# EAGLE design MMaster (EAGLE 6.5.0)
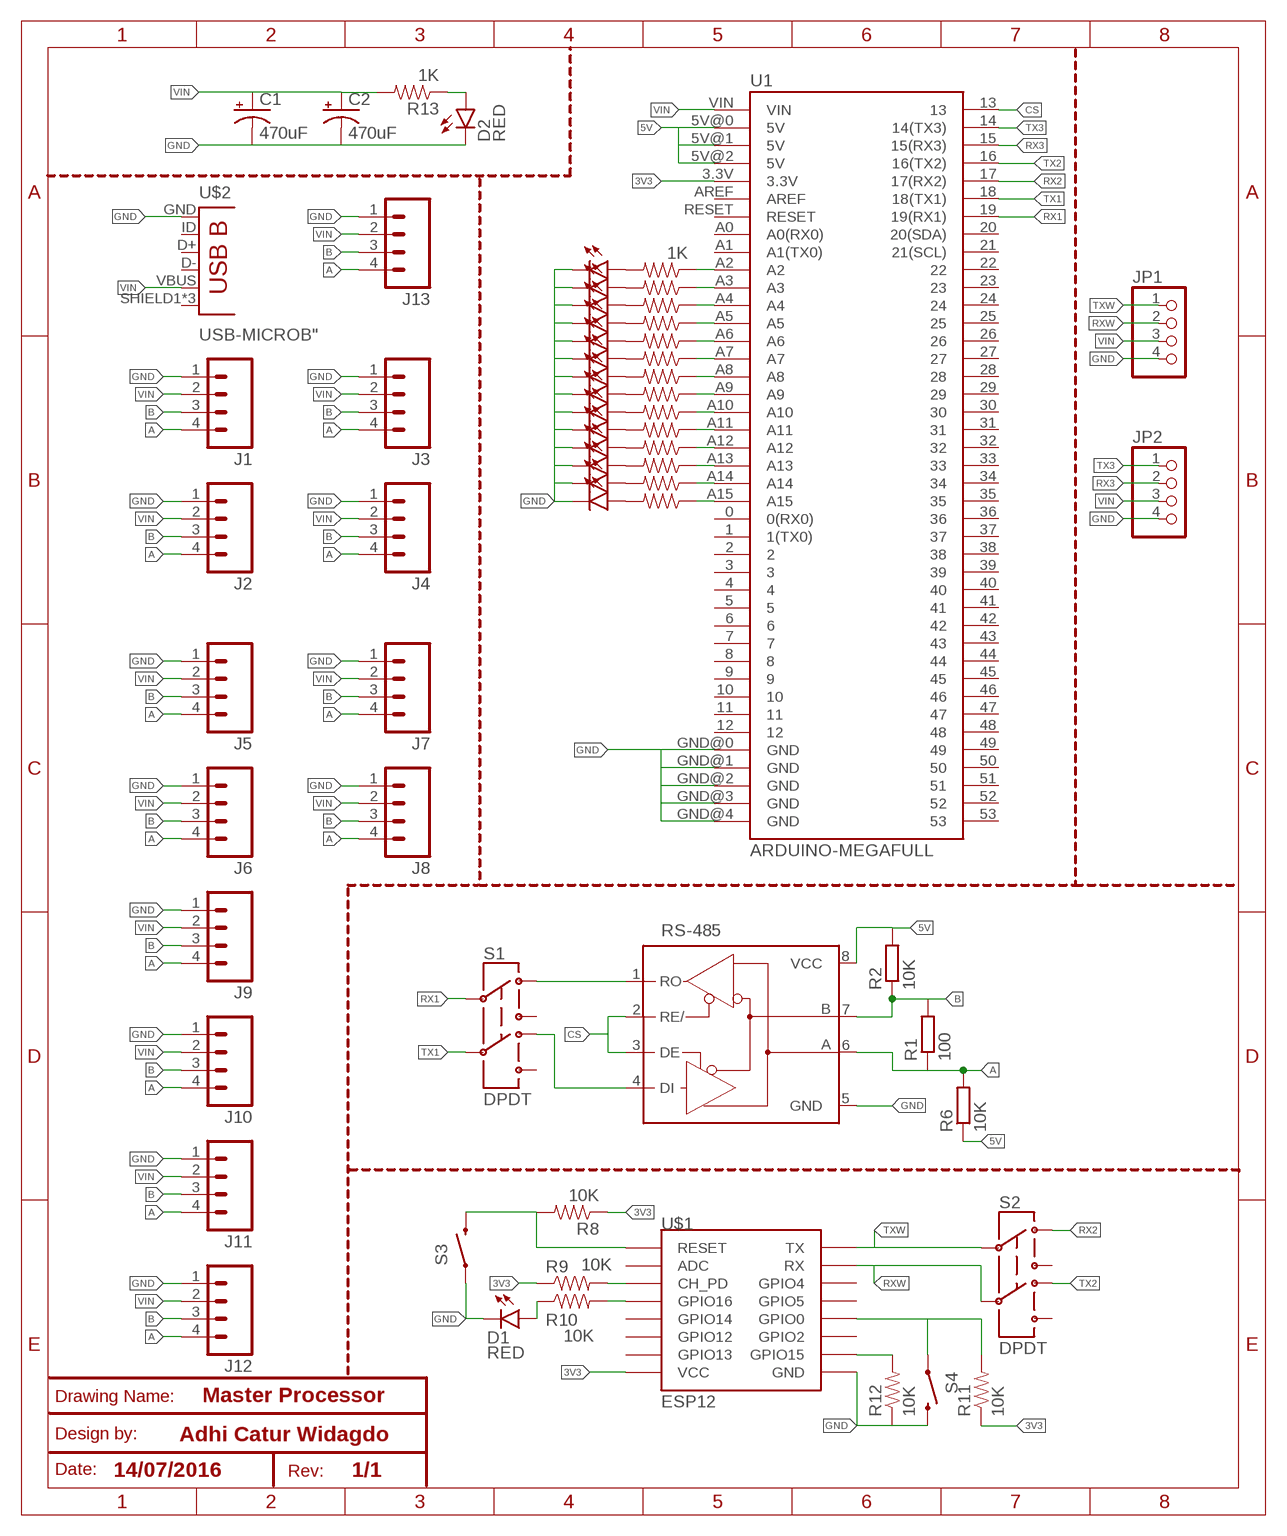
[diagram p0: schematic, sheet 1]

## Parts
C1  470uF  CPOL-USE3.5-8  [E3,5-8]
C2  470uF  CPOL-USE3.5-8  [E3,5-8]
D1  RED  LED-RED0603  [LED-0603]
D2  RED  LED-RED0603  [LED-0603]
D3  RED  LED-RED0603  [LED-0603]
D4  RED  LED-RED0603  [LED-0603]
D5  RED  LED-RED0603  [LED-0603]
D6  RED  LED-RED0603  [LED-0603]
D7  RED  LED-RED0603  [LED-0603]
D8  RED  LED-RED0603  [LED-0603]
D9  RED  LED-RED0603  [LED-0603]
D10  RED  LED-RED0603  [LED-0603]
D11  RED  LED-RED0603  [LED-0603]
D12  RED  LED-RED0603  [LED-0603]
D13  RED  LED-RED0603  [LED-0603]
D14  RED  LED-RED0603  [LED-0603]
D15  RED  LED-RED0603  [LED-0603]
D16  RED  LED-RED0603  [LED-0603]
J1  M04POLAR  [MOLEX-1X4]
J2  M04POLAR  [MOLEX-1X4]
J3  M04POLAR  [MOLEX-1X4]
J4  M04POLAR  [MOLEX-1X4]
J5  M04POLAR  [MOLEX-1X4]
J6  M04POLAR  [MOLEX-1X4]
J7  M04POLAR  [MOLEX-1X4]
J8  M04POLAR  [MOLEX-1X4]
J9  M04POLAR  [MOLEX-1X4]
J10  M04POLAR  [MOLEX-1X4]
J11  M04POLAR  [MOLEX-1X4]
J12  M04POLAR  [MOLEX-1X4]
J13  M04POLAR  [MOLEX-1X4]
JP1  PINHD-1X4  [1X04]
JP2  PINHD-1X4  [1X04]
R1  100  R-EU_0204/7  [0204/7]
R2  10K  R-EU_0204/7  [0204/7]
R6  10K  R-EU_0204/7  [0204/7]
R8  10K  10KOHM-1/10W-1%(0603)0603  [0603-RES]
R9  10K  10KOHM-1/10W-1%(0603)0603  [0603-RES]
R10  10K  10KOHM-1/10W-1%(0603)0603  [0603-RES]
R11  10K  10KOHM-1/10W-1%(0603)0603  [0603-RES]
R12  10K  10KOHM-1/10W-1%(0603)0603  [0603-RES]
R13  1K  10KOHM-1/10W-1%(0603)0603  [0603-RES]
R14  1K  10KOHM-1/10W-1%(0603)0603  [0603-RES]
R15  1K  10KOHM-1/10W-1%(0603)0603  [0603-RES]
R16  1K  10KOHM-1/10W-1%(0603)0603  [0603-RES]
R17  1K  10KOHM-1/10W-1%(0603)0603  [0603-RES]
R18  1K  10KOHM-1/10W-1%(0603)0603  [0603-RES]
R19  1K  10KOHM-1/10W-1%(0603)0603  [0603-RES]
R20  1K  10KOHM-1/10W-1%(0603)0603  [0603-RES]
R21  1K  10KOHM-1/10W-1%(0603)0603  [0603-RES]
R22  1K  10KOHM-1/10W-1%(0603)0603  [0603-RES]
R23  1K  10KOHM-1/10W-1%(0603)0603  [0603-RES]
R24  1K  10KOHM-1/10W-1%(0603)0603  [0603-RES]
R25  1K  10KOHM-1/10W-1%(0603)0603  [0603-RES]
R26  1K  10KOHM-1/10W-1%(0603)0603  [0603-RES]
R27  1K  10KOHM-1/10W-1%(0603)0603  [0603-RES]
RS-485  MAX3468CPA  [DIL08]
S1  DPDT  SWITCH-DPDTAYZ0202  [AYZ0202]
S2  DPDT  SWITCH-DPDTAYZ0202  [AYZ0202]
S3  SWITCH-MOMENTARY-2SMD-1101NE  [TACTILE-SWITCH-1101NE]
S4  SWITCH-MOMENTARY-2SMD-1101NE  [TACTILE-SWITCH-1101NE]
U1  ARDUINO-MEGAFULL  [ARDUINO_MEGA]
U$1  ESP12  [ESP12]
U$2  USB-MICROB"  [USB-B-MICRO-SMD_V03]

## Nets
3V3: R8.1 R9.1 R11.1 U1.3.3V U$1.VCC
5V: R2.2 R6.1 RS-485.8(VCC) U1.5V@0(5V) U1.5V@1(5V) U1.5V@2(5V)
A: J1.4 J2.4 J3.4 J4.4 J5.4 J6.4 J7.4 J8.4 J9.4 J10.4 J11.4 J12.4 J13.4 R1.1 R6.2 RS-485.6(A)
B: J1.3 J2.3 J3.3 J4.3 J5.3 J6.3 J7.3 J8.3 J9.3 J10.3 J11.3 J12.3 J13.3 R1.2 R2.1 RS-485.7(B)
CS: RS-485.2(RE/) RS-485.3(DE) U1.13
GND: C1.- C2.- D1.C D2.C D3.C D4.C D5.C D6.C D7.C D8.C D9.C D10.C D11.C D12.C D13.C D14.C D15.C D16.C J1.1 J2.1 J3.1 J4.1 J5.1 J6.1 J7.1 J8.1 J9.1 J10.1 J11.1 J12.1 J13.1 JP1.4 JP2.4 R12.1 RS-485.5(GND) S3.1 S4.2 U1.GND@0(GND) U1.GND@1(GND) U1.GND@2(GND) U1.GND@3(GND) U1.GND@4(GND) U$1.GND U$2.GND
N$1: RS-485.1(RO) S1.1
N$2: RS-485.4(DI) S1.4
N$3: R12.2 U$1.GPIO15
N$4: R10.2 U$1.GPIO16
N$5: R11.2 S4.1 U$1.GPIO0
N$6: D1.A R10.1
N$7: R8.2 S3.2 U$1.RESET
N$8: R9.2 U$1.CH_PD
N$9: D2.A R13.1
N$10: R27.1 U1.A15
N$11: R26.1 U1.A14
N$12: R25.1 U1.A13
N$13: R24.1 U1.A12
N$14: R23.1 U1.A11
N$15: R22.1 U1.A10
N$16: R21.1 U1.A9
N$17: R20.1 U1.A8
N$18: R19.1 U1.A7
N$19: R18.1 U1.A6
N$20: R17.1 U1.A5
N$21: R16.1 U1.A4
N$22: R15.1 U1.A3
N$23: R14.1 U1.A2
N$24: D3.A R14.2
N$25: D4.A R15.2
N$26: D5.A R16.2
N$27: D6.A R17.2
N$28: D7.A R18.2
N$29: D8.A R19.2
N$30: D9.A R20.2
N$31: D10.A R21.2
N$32: D11.A R22.2
N$33: D12.A R23.2
N$34: D13.A R24.2
N$35: D14.A R25.2
N$36: D15.A R26.2
N$37: D16.A R27.2
RX1: S1.2 U1.19(19(RX1))
RX2: S2.1 U1.17(17(RX2))
RX3: JP2.2 U1.15(15(RX3))
RXW: JP1.2 S2.5 U$1.RX
TX1: S1.5 U1.18(18(TX1))
TX2: S2.4 U1.16(16(TX2))
TX3: JP2.1 U1.14(14(TX3))
TXW: JP1.1 S2.2 U$1.TX
VIN: C1.+ C2.+ J1.2 J2.2 J3.2 J4.2 J5.2 J6.2 J7.2 J8.2 J9.2 J10.2 J11.2 J12.2 J13.2 JP1.3 JP2.3 R13.2 U1.VIN U$2.VBUS
Unconnected: S1.3 S1.6 S2.3 S2.6 U1.0(0(RX0)) U1.1(1(TX0)) U1.2 U1.3 U1.4 U1.5 U1.6 U1.7 U1.8 U1.9 U1.10 U1.11 U1.12 U1.20(20(SDA)) U1.21(21(SCL)) U1.22 U1.23 U1.24 U1.25 U1.26 U1.27 U1.28 U1.29 U1.30 U1.31 U1.32 U1.33 U1.34 U1.35 U1.36 U1.37 U1.38 U1.39 U1.40 U1.41 U1.42 U1.43 U1.44 U1.45 U1.46 U1.47 U1.48 U1.49 U1.50 U1.51 U1.52 U1.53 U1.A0(A0(RX0)) U1.A1(A1(TX0)) U1.AREF U1.RESET U$1.ADC U$1.GPIO2 U$1.GPIO4 U$1.GPIO5 U$1.GPIO12 U$1.GPIO13 U$1.GPIO14 U$2.D+ U$2.D- U$2.ID(USBID) U$2.SHIELD1(SHIELD) U$2.SHIELD2(SHIELD) U$2.SHIELD3(SHIELD)

## Notes on the sheet
- Drawing Name: | Master Processor
- Design by: | Adhi Catur Widagdo
- Date: | 14/07/2016 | Rev: | 1/1

## Library data of the parts
C1 C2 = rcl:CPOL-US: POLARIZED CAPACITOR, American symbol
D1-D16 = SparkFun-LED:LED-RED: Assorted Red LEDs LilyPad 1206- DIO-09912 1206- DIO-00809 0603- DIO-00819 "SMART" means more efficient and expensive; PROD_ID: DIO-00819
J1-J13 = SparkFun-Connectors:M04: Header 4 Standard 4-pin 0.1" header. Use with straight break away headers (SKU : PRT-00116), right angle break away headers (PRT-00553), swiss pins (PRT-00743), machine pins (PRT-00117), and female headers (PRT-00115). Molex polarized connector foot print use with SKU : PRT-08231 with associated crimp pins and housings. 1MM SMD Version SKU: PRT-10208
JP1 JP2 = pinhead:PINHD-1X4: PIN HEADER
R1 R2 R6 = rcl:R-EU_: RESISTOR, European symbol
R8-R12 = SparkFun-Resistors:10KOHM-1/10W-1%(0603): RES-00824; PROD_ID: RES-00824
R13-R27 = SparkFun-Resistors:10KOHM-1/10W-1%(0603): RES-00824; PROD_ID: RES-00824; VALUE: 10K
RS-485 = maxim:MAX34*: +5V, Fail-Safe, 40Mbps, Profibus RS-485/RS-422 Transceivers Source: MAX3465-MAX3469.pdf; OC_FARNELL: unknown; OC_NEWARK: unknown
S1 S2 = SparkFun-Electromechanical:SWITCH-DPDT: DPDT Version of the COM-00597; PROD_ID: SWCH-08179
S3 S4 = SparkFun-Electromechanical:SWITCH-MOMENTARY-2: Various NO switches- pushbuttons, reed, etc; PROD_ID: SWCH-00815
U1 = SparkFun-Boards:ARDUINO-MEGA: Arduino Mega board footprint
U$1 = esp8266:ESP12: ESP8266 Wifi module 12
U$2 = SparkFun-Connectors:USB-MICROB; PROD_ID: CONN-11752

## Board
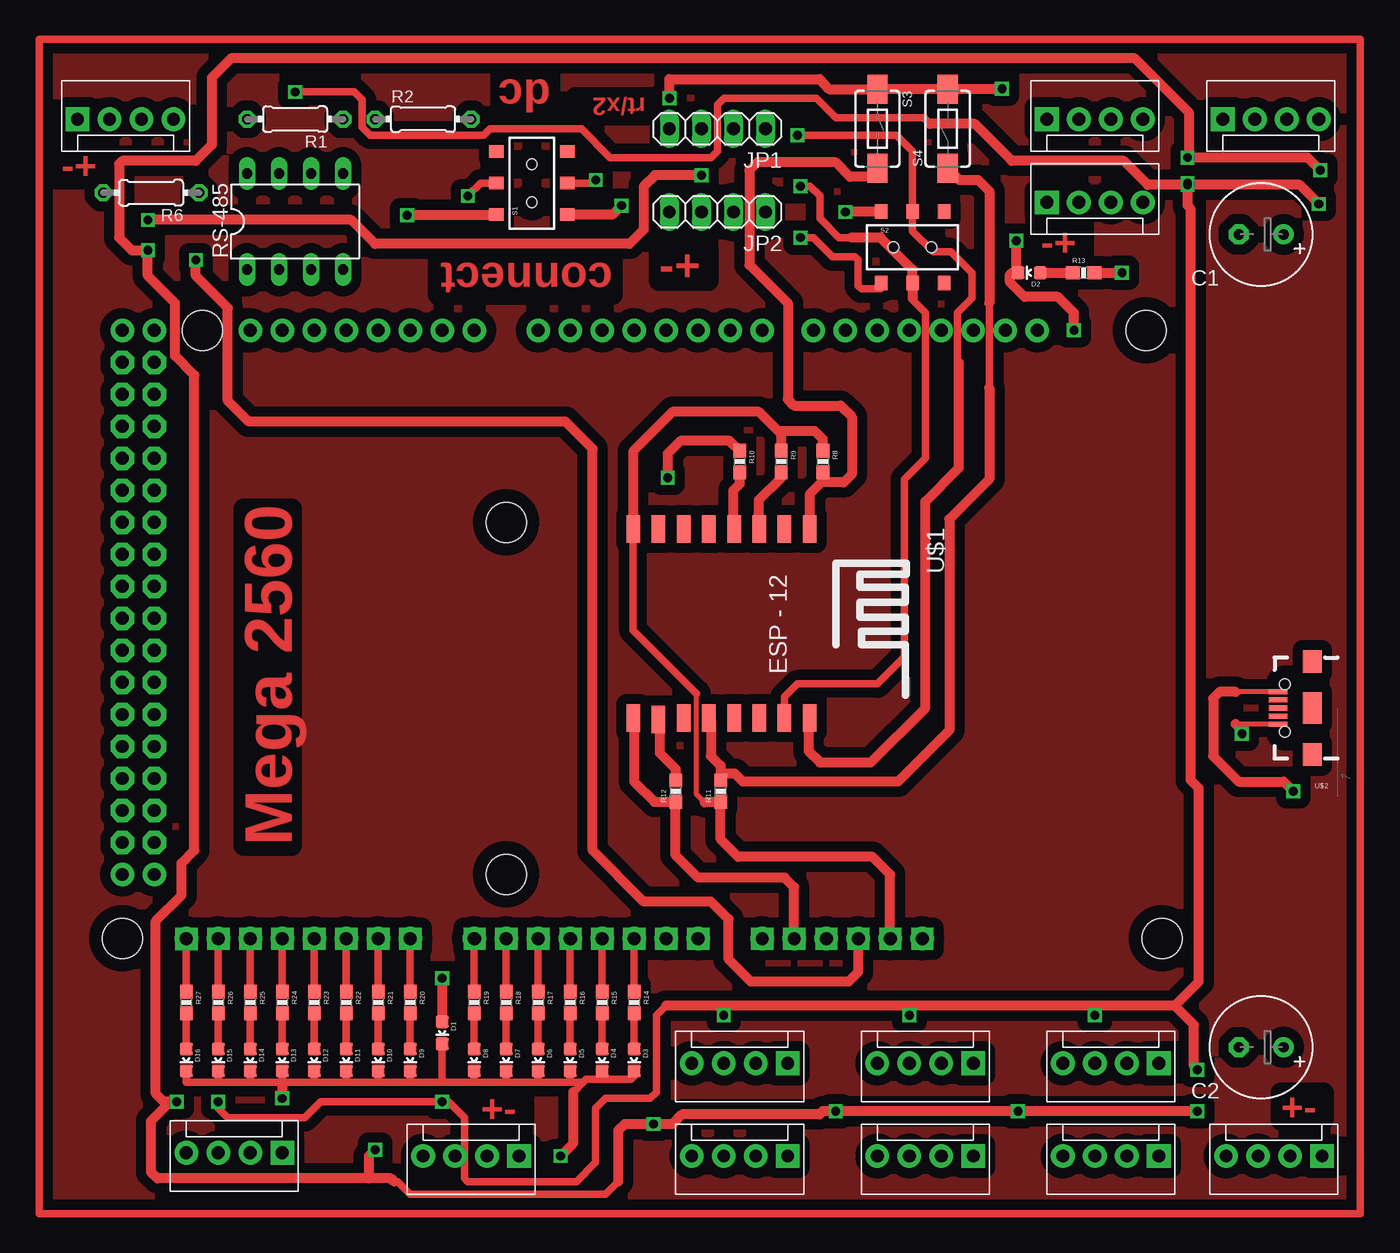
[diagram p1: board, top side]
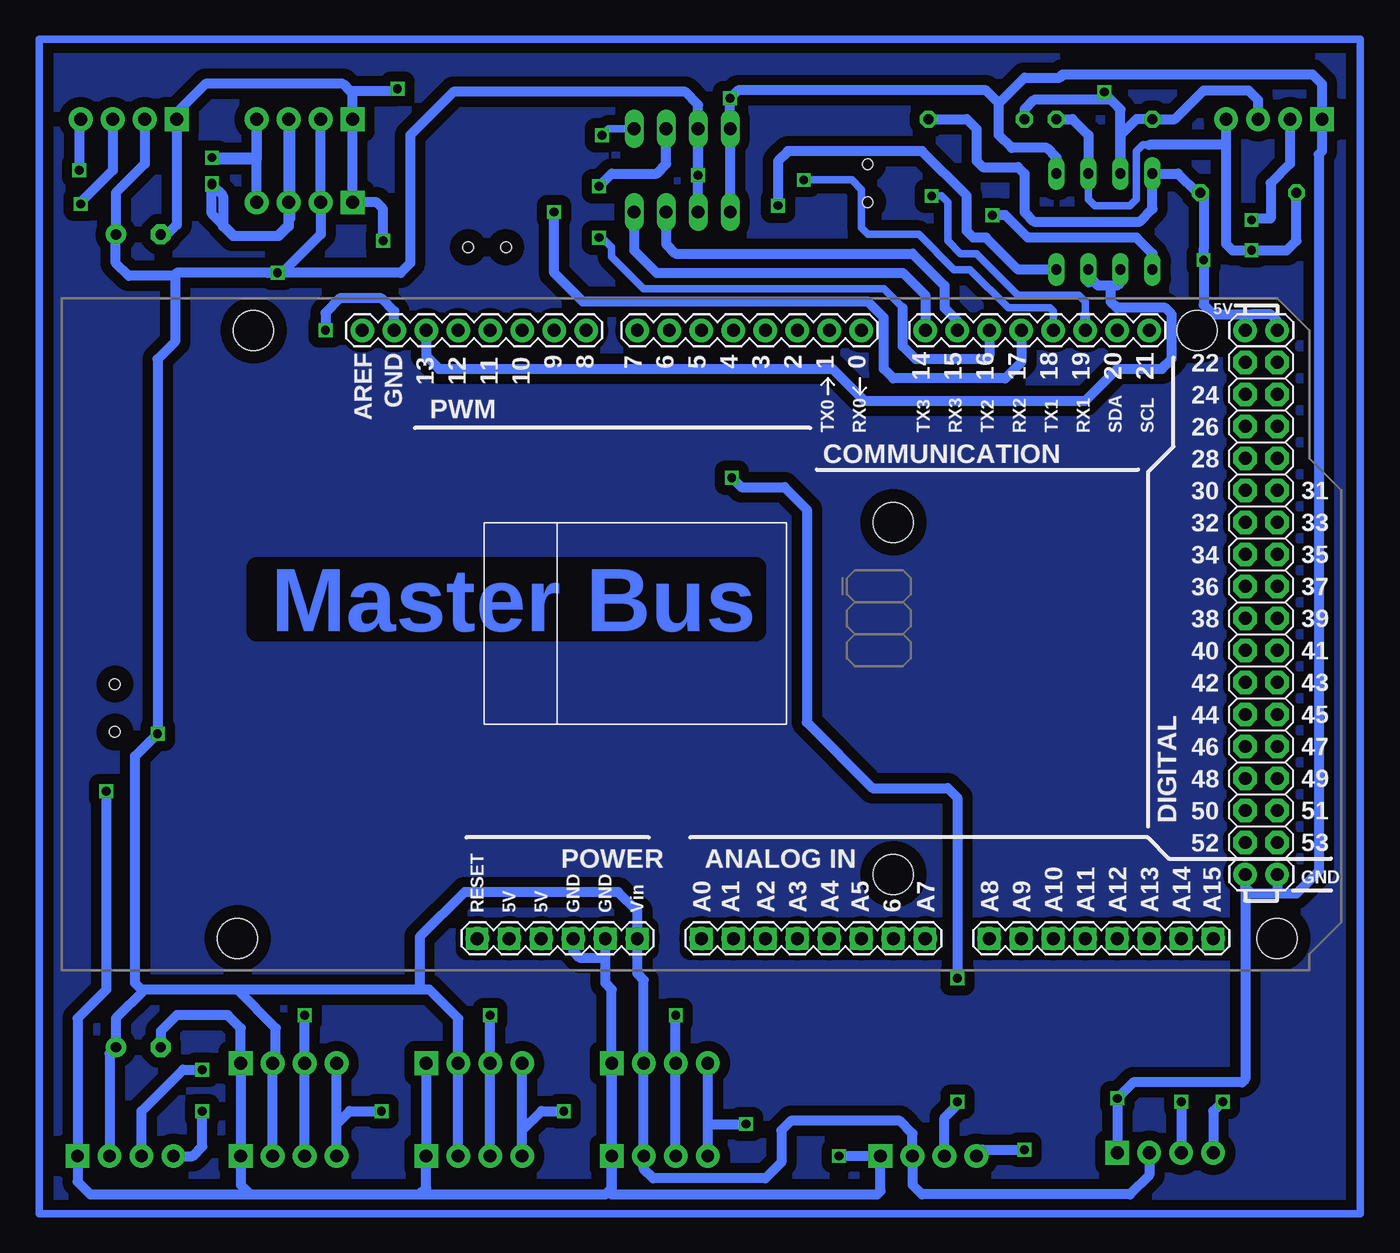
[diagram p2: board, bottom side, seen from below]

No outline drawn. Coordinates in mm, seen from the top.
Copper layers (1*16): Top 0.035mm / dielectric 1.5mm / Bottom 0.035mm
Design rules "default": minimum track width 10mil, minimum drill 24mil, track to track 8mil, track to pad 8mil, pad to pad 8mil, via to via 8mil, smd to smd 8mil, copper to edge 40mil, drill to drill 8mil, minimum pad ring 10mil, minimum via ring 8mil, stop-mask expansion 4mil, vias tented up to drill 0mil, thermal gap 10mil

### Footprints (pad centres in the part's own frame; a part is rotated, then mirrored left to right if it is on the bottom)
E3,5-8 = drill 0.813 pad 1.6: + -1.778,0 | drill 0.813 pad 1.6 octagon: - 1.778,0
LED-0603 = smd 1 x 1: A 0,-0.877; C 0,0.877
MOLEX-1X4 = drill 1.016 pad 1.88 square: 1 0,0 | drill 1.016 pad 1.88: 2 2.54,0; 3 5.08,0; 4 7.62,0
1X04 = drill 1.016 long: 1 -3.81,0; 2 -1.27,0; 3 1.27,0; 4 3.81,0
0204/7 = drill 0.813 octagon: 1 -3.81,0; 2 3.81,0
0603-RES = smd 1.1 x 1: 1 -0.85,0; 2 0.85,0
DIL08 = drill 0.813 long: 1 -3.81,-3.81; 2 -1.27,-3.81; 3 1.27,-3.81; 4 3.81,-3.81; 5 3.81,3.81; 6 1.27,3.81; 7 -1.27,3.81; 8 -3.81,3.81
AYZ0202 = smd 1 x 1.15: 1 -2.5,2.825; 2 0,2.825; 3 2.5,2.825; 4 -2.5,-2.825; 5 0,-2.825; 6 2.5,-2.825 | hole 0.85: 1.5,0; -1.5,0
TACTILE-SWITCH-1101NE = smd 2.3 x 1.6: 1 -3.15,0; 2 3.15,0
ARDUINO_MEGA = drill 1.016 pad 1.88: 0 63.5,50.8; 1 60.96,50.8; 2 58.42,50.8; 3 55.88,50.8; 3.3V 35.56,2.54; 4 53.34,50.8; 5 50.8,50.8; 5V@0 38.1,2.54; 5V@1 93.98,50.8; 5V@2 96.52,50.8; 6 48.26,50.8; 7 45.72,50.8; 8 41.656,50.8; 9 39.116,50.8; 10 36.576,50.8; 11 34.036,50.8; 12 31.496,50.8; 13 28.956,50.8; 14 68.58,50.8; 15 71.12,50.8; 16 73.66,50.8; 17 76.2,50.8; 18 78.74,50.8; 19 81.28,50.8; 20 83.82,50.8; 21 86.36,50.8; A0 50.8,2.54; A1 53.34,2.54; A2 55.88,2.54; A3 58.42,2.54; A4 60.96,2.54; A5 63.5,2.54; A6 66.04,2.54; A7 68.58,2.54; A8 73.66,2.54; A9 76.2,2.54; A10 78.74,2.54; A11 81.28,2.54; A12 83.82,2.54; A13 86.36,2.54; A14 88.9,2.54; A15 91.44,2.54; AREF 23.876,50.8; GND@0 40.64,2.54; GND@1 43.18,2.54; GND@2 93.98,7.62; GND@3 96.52,7.62; GND@4 26.416,50.8; RESET 33.02,2.54; VIN 45.72,2.54 | drill 1.016 pad 1.88 octagon: 22 93.98,48.26; 23 96.52,48.26; 24 93.98,45.72; 25 96.52,45.72; 26 93.98,43.18; 27 96.52,43.18; 28 93.98,40.64; 29 96.52,40.64; 30 93.98,38.1; 31 96.52,38.1; 32 93.98,35.56; 33 96.52,35.56; 34 93.98,33.02; 35 96.52,33.02; 36 93.98,30.48; 37 96.52,30.48; 38 93.98,27.94; 39 96.52,27.94; 40 93.98,25.4; 41 96.52,25.4; 42 93.98,22.86; 43 96.52,22.86; 44 93.98,20.32; 45 96.52,20.32; 46 93.98,17.78; 47 96.52,17.78; 48 93.98,15.24; 49 96.52,15.24; 50 93.98,12.7; 51 96.52,12.7; 52 93.98,10.16; 53 96.52,10.16 | hole 3.2: 15.24,50.8; 13.97,2.54; 66.04,35.56; 66.04,7.62; 90.17,50.8; 96.52,2.54
ESP12 = smd 2.184 x 1.067: ADC -7.6,3.8; CH_PD -7.6,1.8; GND 7.4,-8.2; GPIO0 7.4,-2.2; GPIO2 7.4,-4.2; GPIO4 7.4,1.8; GPIO5 7.4,-0.2; GPIO12 -7.6,-4.2; GPIO13 -7.6,-6.2; GPIO14 -7.6,-2.2; GPIO15 7.5,-6.2; GPIO16 -7.6,-0.2; RESET -7.6,5.8; RX 7.4,3.8; TX 7.4,5.8; VCC -7.6,-8.2
USB-B-MICRO-SMD_V03 = smd 1.45 x 0.4: D+ 2.725,0; D- 2.725,0.65; GND 2.725,-1.3; ID 2.725,-0.65; VBUS 2.725,1.3 | smd 1.5 x 1.8: SHIELD1 0,3.685; SHIELD2 0,-3.685 | smd 1.5 x 2.5: SHIELD3 0,0 | hole 0.85: 2.2,1.9; 2.2,-1.9

### Placement (x,y rotation side)
C1  98.04,-2.54 180 top
C2  98.04,-67.06 180 top
D1  33.02,-65.91 180 top
D2  79.63,-5.59 90 top
D3  48.26,-68.07 180 top
D4  45.72,-68.07 180 top
D5  43.18,-68.07 180 top
D6  40.64,-68.07 180 top
D7  38.1,-68.07 180 top
D8  35.56,-68.07 180 top
D9  30.48,-68.07 180 top
D10  27.94,-68.07 180 top
D11  25.4,-68.07 180 top
D12  22.86,-68.07 180 top
D13  20.32,-68.07 180 top
D14  17.78,-68.07 180 top
D15  15.24,-68.07 180 top
D16  12.7,-68.07 180 top
J1  4.06,6.6 0 top
J2  81.03,0 0 top
J3  81.03,6.6 0 top
J4  95,6.6 0 top
J5  20.32,-75.44 180 top
J6  39.12,-75.69 180 top
J7  60.45,-68.33 180 top
J8  60.45,-75.69 180 top
J9  75.18,-68.33 180 top
J10  75.18,-75.69 180 top
J11  89.92,-68.33 180 top
J12  89.92,-75.69 180 top
J13  102.87,-75.69 180 top
JP1  54.86,5.84 180 top
JP2  54.86,-0.76 180 top
R1  21.34,6.6 180 top
R2  31.5,6.6 0 top
R6  9.91,0.76 180 top
R8  63.25,-20.57 270 top
R9  59.94,-20.57 270 top
R10  56.64,-20.57 270 top
R11  55.12,-46.74 90 top
R12  51.56,-46.74 90 top
R13  83.95,-5.59 0 top
R14  48.26,-63.5 270 top
R15  45.72,-63.5 270 top
R16  43.18,-63.5 270 top
R17  40.64,-63.5 270 top
R18  38.1,-63.5 270 top
R19  35.56,-63.5 270 top
R20  30.48,-63.5 270 top
R21  27.94,-63.5 270 top
R22  25.4,-63.5 270 top
R23  22.86,-63.5 270 top
R24  20.32,-63.5 270 top
R25  17.78,-63.5 270 top
R26  15.24,-63.5 270 top
R27  12.7,-63.5 270 top
RS-485  21.34,-1.52 0 top
S1  40.13,1.52 90 top
S2  70.36,-3.56 0 top
S3  67.56,5.84 270 top
S4  73.15,5.84 90 top
U1  104.14,-60.96 0 bottom
U$1  56.39,-33.53 270 top
U$2  102.11,-40.13 180 top

### Tracks (layer width: path | path; a pad name or v marks a point on that pad's centre or on a via)
3V3
  Top 0.406: 53.85,-47.62 53.21,-46.99 53.21,-38.99
  Top 0.61: 53.21,-38.99 48.19,-33.96 U$1.VCC
  Top 0.813: R8.1 63.25,-18.8 62.61,-18.16 59.94,-18.16 59.94,-18.41 | R9.1 59.94,-18.41 | 59.94,-18.41 58.17,-16.64 51.31,-16.64 48.19,-19.76 U$1.VCC | U1.3.3V 68.58,-53.34 67.18,-51.94 56.52,-51.94 55.12,-50.55 R11.1 55.08,-47.62 53.85,-47.62
5V  (via drill 0.7 pad 0.61)
  Top 0.813: U1.5V@0 66.04,-61.09 65.28,-61.85 57.53,-61.85 55.75,-60.07 55.75,-56.9 54.36,-55.5 49.02,-55.5 44.96,-51.44 44.96,-19.56 42.8,-17.4 17.65,-17.4 16,-15.75 16,-8.38 13.46,-5.84 v13.46,-4.57
  Bottom 0.813: U1.5V@2 7.62,-9.4 8.13,-8.89 9.65,-8.89 | 9.65,-8.89 10.16,-9.4 U1.5V@1 | 9.65,-8.89 12.7,-8.89 13.46,-8.13 v13.46,-4.57 13.46,-3.68 13.46,0.51 R6.1 13.97,0.76 15.49,2.29 RS-485.8 17.53,-0.51 18.54,-1.52 26.92,-1.52 27.69,-0.76 27.69,2.29 28.19,2.79 30.99,2.79 31.5,3.3 31.5,5.84 32.26,6.6 R2.2
A  (via drill 0.7 pad 0.61)
  Top 0.61: 46.99,-77.72 45.97,-78.74 30.48,-78.74 29.46,-77.72 29.21,-77.72
  Top 0.813: v92.96,-72.14 v78.74,-72.14 v64.26,-72.14 63.25,-72.14 62.99,-72.39 52.07,-72.39 51.31,-73.15 v49.78,-73.15 47.5,-73.15 46.99,-73.66 46.99,-77.72 | 29.21,-77.72 28.96,-77.47 27.18,-77.47 | 27.18,-77.47 10.41,-77.47 9.91,-76.96 9.91,-72.9 11.43,-71.37 v11.94,-71.37 10.92,-71.37 10.29,-70.74 10.29,-57.02 12.32,-54.99 12.32,-52.45 13.34,-51.44 13.34,-13.72 11.81,-12.19 11.81,-8 9.65,-5.84 v9.65,-3.81 8.38,-3.81 7.37,-2.79 7.37,3.05 7.62,3.3 13.46,3.3 14.73,4.57 14.73,9.91 16.26,11.43 88.01,11.43 92.33,7.11 92.33,3.56 | v27.69,-75.18 27.18,-75.69 27.18,-77.47 | v102.74,2.54 101.73,3.56 92.33,3.56 | 92.33,3.56 v92.2,3.56
  Bottom 0.61: 17.78,4.57 18.29,4.57 18.8,4.06 18.8,0.25 19.3,-0.25 22.1,-0.25 22.61,0.25 RS-485.6
  Bottom 0.813: J11.4 J12.4 82.3,-73.15 81.28,-72.14 v78.74,-72.14 | J9.4 J10.4 67.56,-73.66 66.04,-72.14 v64.26,-72.14 | 52.83,-73.15 J7.4 | J13.4 93.73,-75.69 92.96,-74.93 v92.96,-72.14 | v11.94,-71.37 12.7,-72.14 J5.4 | J6.4 30.99,-75.18 v27.69,-75.18 | J8.4 52.83,-73.15 | 52.83,-73.15 v49.78,-73.15 | J2.4 88.65,3.43 | 88.65,3.43 J3.4 88.65,3.68 88.77,3.56 92.33,3.56 | R1.1 23.88,6.6 22.61,5.33 RS-485.6 | 11.68,4.57 11.68,-3.3 11.18,-3.81 v9.65,-3.81 6.86,-3.81 6.1,-3.05 R6.2 | J1.4 11.68,4.57 | 11.68,4.57 17.78,4.57 | J4.4 102.74,6.48 v102.74,2.54 | v92.2,3.56 92.08,3.43 88.65,3.43
B  (via drill 0.7 pad 0.61)
  Top 0.61: 50.8,-63.75 50.04,-64.52 50.04,-70.61 49.53,-71.12 45.97,-71.12 45.21,-71.88 45.21,-76.2 43.69,-77.72 35.05,-77.72 34.8,-77.47 34.8,-72.64 33.53,-71.37 33.27,-71.37 | v33.02,-71.37 23.37,-71.37 22.1,-72.64 16,-72.64 15.24,-71.88 v15.24,-71.37 | 71.75,6.22 71.25,6.73 64.26,6.73 62.74,8.26 55.37,8.26 54.86,7.75 54.86,4.06 54.36,3.56 46.35,3.56 44.07,5.84 36.83,5.84 36.32,5.33 27.3,5.33 26.67,5.97 26.67,8.13 26.04,8.76 v21.34,8.76
  Top 0.813: v92.96,-68.83 92.71,-68.58 92.71,-65.28 91.19,-63.75 | 91.19,-63.75 84.84,-63.75 | 84.84,-63.75 70.1,-63.75 | 70.1,-63.75 55.37,-63.75 | 55.37,-63.75 50.8,-63.75 | v84.84,-64.52 84.84,-63.75 | v70.1,-64.52 70.1,-63.75 | v55.37,-64.52 55.37,-63.75 | v33.02,-71.37 33.27,-71.37 | v102.62,-0.13 101.09,1.4 v92.2,1.4 92.2,-0.25 92.46,-0.51 92.46,-45.85 93.09,-46.48 93.09,-61.85 91.19,-63.75 | v92.2,1.52 92.08,1.4 89.03,1.4 87.12,3.3 78.23,3.3 75.31,6.22 71.75,6.22
  Bottom 0.61: v21.34,8.76 20.19,7.62 20.19,7.49
  Bottom 0.813: J12.3 J11.3 v84.84,-64.52 | J8.3 J7.3 v55.37,-64.52 | J13.3 97.79,-72.14 94.49,-68.83 v92.96,-68.83 | v15.24,-71.37 J5.3 | J10.3 J9.3 v70.1,-64.52 | J6.3 34.04,-72.64 33.02,-71.63 v33.02,-71.37 | J1.3 9.14,8.13 9.91,8.89 13.46,8.89 15.75,6.6 R1.2 18.8,6.6 20.07,5.33 RS-485.7 20.07,7.37 20.19,7.49 20.83,8.13 26.92,8.13 27.69,7.37 R2.1 | J4.3 100.08,2.54 102.62,0 v102.62,-0.13 | v92.2,1.4 91.31,0.51 91.31,-1.91 90.55,-2.67 90.42,-2.67 | 90.42,-2.67 87,-2.67 | 87,-2.67 86.11,-1.78 J2.3 J3.3 85.98,6.48 85.98,-1.27 86.11,-1.4 86.11,-1.91 86.87,-2.67 87,-2.67 | 90.42,-2.67 92.2,-0.89 v92.2,1.52
CS
  Bottom 0.813: RS-485.2 20.07,-6.35 20.32,-6.6 20.83,-6.6 | 20.83,-6.6 21.84,-6.6 22.61,-5.84 RS-485.3 22.61,-6.35 | U1.13 75.18,-12.19 74.17,-13.21 42.93,-13.21 40.39,-15.75 22.86,-15.75 20.32,-13.21 16.76,-13.21 16,-12.45 16,-8.89 16.51,-8.38 20.32,-8.38 20.83,-7.87 20.83,-6.6
GND  (via drill 0.7 pad 0.61, 1 pad 1.78)
  Top 0.406: U$2.GND 96.04,-38.83 96.01,-38.86
  Top 0.61: 43.43,-70.61 44.2,-69.85 | 44.2,-69.85 44.45,-69.6 45.72,-69.6 | 45.72,-69.6 48.01,-69.6 48.26,-69.34 D3.C | D16.C 12.7,-69.85 15.24,-69.85 | 15.24,-69.85 17.78,-69.85 | 17.78,-69.85 20.32,-69.85 | 20.32,-69.85 22.86,-69.85 | 22.86,-69.85 25.4,-69.85 | 25.4,-69.85 27.94,-69.85 | 27.94,-69.85 30.48,-69.85 | 30.48,-69.85 32.89,-69.85 33.02,-69.85 | 33.02,-69.85 35.56,-69.85 | 35.56,-69.85 38.1,-69.85 | 38.1,-69.85 40.64,-69.85 | 40.64,-69.85 43.18,-69.85 | 43.18,-69.85 44.2,-69.85 | D4.C 45.72,-69.6 | D5.C 43.18,-69.85 | D6.C 40.64,-69.85 | D7.C 38.1,-69.85 | D8.C 35.56,-69.85 | D9.C 30.48,-69.85 | D10.C 27.94,-69.85 | D11.C 25.4,-69.85 | D12.C 22.86,-69.85 | D13.C 20.32,-69.85 | D14.C 17.78,-69.85 | D15.C 15.24,-69.85 | D1.C 33.02,-69.85
  Top 0.813: v42.42,-75.69 43.43,-74.68 43.43,-70.61 | 20.32,-69.85 v20.32,-71.12 | U$1.GND 48.26,-41 48.26,-45.97 49.87,-47.59 R12.1 51.56,-51.82 53.34,-53.59 60.2,-53.59 60.96,-54.36 U1.GND@1 | 96.01,-38.86 94.74,-38.86 94.23,-39.37 94.23,-43.94 96.27,-45.97 99.82,-45.97 v100.58,-46.74 | v51.05,8.26 51.05,9.78 62.99,9.78 63.73,8.99 S3.1 S4.2 73.18,9.02 v77.47,9.02 | v83.19,-10.16 83.19,-8.76 81.92,-7.49 79.25,-7.49 78.11,-6.35 78.11,-5.71 78.23,-5.59 D2.C 78.61,-5.45 v78.61,-3.05
  Bottom 0.813: C2.- 96.27,-65.79 95,-64.52 90.93,-64.52 89.92,-65.53 J11.1 J12.1 89.92,-77.98 89.15,-78.74 | J7.1 J8.1 60.45,-78.23 60.96,-78.74 75.69,-78.74 | 75.18,-76.45 J10.1 | v42.42,-75.69 J6.1 39.12,-78.49 39.37,-78.74 60.45,-78.74 J7.1 | J7.1 60.45,-62.48 60.96,-61.98 60.96,-59.94 | 60.96,-59.94 v60.96,-58.45 U1.GND@1 | U1.GND@0 63.5,-59.44 62.99,-59.94 60.96,-59.94 | J5.1 v20.32,-71.12 19.05,-69.85 10.41,-69.85 10.16,-69.6 U1.GND@2 10.16,-54.36 9.65,-54.86 7.87,-54.86 | U1.GND@3 7.62,-54.61 7.87,-54.86 | 89.15,-78.74 101.85,-78.74 102.87,-77.72 J13.1 102.87,-64.77 100.58,-62.48 v100.58,-46.74 | J9.1 J10.1 | 89.15,-78.74 75.69,-78.74 | 75.69,-78.74 75.18,-78.23 J10.1 | C1.- 95.76,-2.54 95,-1.78 J4.1 95,7.11 92.71,9.4 81.79,9.4 81.22,8.83 | 81.22,8.83 81.03,8.64 J3.1 J2.1 79.12,0 78.61,-0.51 v78.61,-3.05 | JP2.4 JP1.4 v51.05,8.26 50.42,8.89 30.73,8.89 29.72,7.87 | 7.87,-54.86 6.1,-54.86 4.32,-53.09 4.32,3.81 4.06,4.06 J1.1 4.06,9.4 4.83,10.16 24.64,10.16 24.89,9.91 27.69,9.91 29.72,7.87 | RS-485.5 25.15,3.56 25.91,4.32 28.7,4.32 29.72,5.33 29.72,7.87 | v77.47,9.02 77.66,8.83 81.22,8.83 | U1.GND@4 77.72,-8.64 78.74,-7.62 82.04,-7.62 83.19,-8.76 v83.19,-10.16
N$1  (via drill 0.7 pad 0.61)
  Top 0.813: v30.23,-1.02 30.27,-0.98 S1.1
  Bottom 0.813: RS-485.1 17.53,-4.06 18.8,-2.79 27.43,-2.79 29.21,-1.02 v30.23,-1.02
N$2  (via drill 0.7 pad 0.61)
  Top 0.813: v47.24,-0.25 46.52,-0.98 S1.4
  Bottom 0.813: RS-485.4 28.19,-5.33 30.73,-2.79 31.75,-2.79 32.26,-2.29 32.26,0.51 35.81,4.06 46.48,4.06 47.24,3.3 v47.24,-0.25
N$3
  Top 0.813: U$1.GPIO15 50.29,-41.13 50.29,-43.69 51.56,-44.96 R12.2
N$4
  Top 0.813: U$1.GPIO16 56.13,-25.87 56.13,-22.86 56.64,-22.35 R10.2
N$5
  Top 0.61: 76.45,-8 76.45,-14.73
  Top 0.813: U$1.GPIO0 54.36,-41.1 54.36,-43.94 55.12,-44.7 55.12,-45.34 | 55.12,-45.34 R11.2 | S4.1 74.07,1.78 75.56,1.78 76.45,0.89 76.45,-8 | 76.45,-14.73 76.45,-21.97 73.28,-25.15 73.28,-41.91 69.22,-45.97 56.9,-45.97 56.26,-45.34 55.12,-45.34
N$6  (via drill 0.7 pad 0.61)
  Top 0.813: R10.1 55.84,-18.92 51.94,-18.92 50.93,-19.94 v50.93,-21.84 | v33.02,-61.59 D1.A
  Bottom 0.813: v50.93,-21.84 50.16,-22.61 46.74,-22.61 44.96,-24.38 44.96,-41.27 39.75,-46.48 33.78,-46.48 33.02,-47.24 v33.02,-61.59
N$7
  Top 0.813: U$1.RESET 62.23,-25.89 62.23,-23.11 63.12,-22.23 | 63.12,-22.23 63.25,-22.1 R8.2 | S3.2 66.9,2.03 65.41,2.03 64.26,3.17 58.04,3.17 57.4,2.54 57.4,-4.95 60.45,-8 60.45,-15.62 60.96,-16.13 64.64,-16.13 65.53,-17.02 65.53,-21.59 64.9,-22.23 63.12,-22.23
N$8
  Top 0.813: U$1.CH_PD 58.17,-25.91 58.17,-23.62 59.94,-21.84 R9.2
N$9
  Top 0.813: D2.A R13.1
N$10  (via drill 1 pad 1.78)
  Top 0.61: R27.1 v12.7,-58.47 U1.A15
N$11  (via drill 1 pad 1.78)
  Top 0.61: R26.1 v15.24,-58.45 U1.A14
N$12  (via drill 1 pad 1.78)
  Top 0.61: R25.1 v17.78,-58.45 U1.A13
N$13  (via drill 1 pad 1.78)
  Top 0.61: R24.1 v20.32,-58.45 U1.A12
N$14  (via drill 1 pad 1.78)
  Top 0.61: R23.1 v22.86,-58.45 U1.A11
N$15  (via drill 1 pad 1.78)
  Top 0.61: R22.1 v25.4,-58.45 U1.A10
N$16  (via drill 1 pad 1.78)
  Top 0.61: R21.1 v27.94,-58.45 U1.A9
N$17  (via drill 1 pad 1.78)
  Top 0.61: R20.1 v30.48,-58.45 U1.A8
N$18
  Top 0.61: R19.1 U1.A7
N$19  (via drill 1 pad 1.78)
  Top 0.61: R18.1 v38.1,-58.45 U1.A6
N$20  (via drill 1 pad 1.78)
  Top 0.61: R17.1 v40.64,-58.45 U1.A5
N$21
  Top 0.61: R16.1 U1.A4
N$22  (via drill 1 pad 1.78)
  Top 0.61: R15.1 v45.72,-58.45 U1.A3
N$23  (via drill 1 pad 1.78)
  Top 0.61: R14.1 v48.26,-58.45 U1.A2
N$24
  Top 0.61: R14.2 D3.A
N$25
  Top 0.61: R15.2 D4.A
N$26
  Top 0.61: R16.2 D5.A
N$27
  Top 0.61: R17.2 D6.A
N$28
  Top 0.61: R18.2 D7.A
N$29
  Top 0.61: R19.2 D8.A
N$30
  Top 0.61: R20.2 D9.A
N$31
  Top 0.61: R21.2 D10.A
N$32
  Top 0.61: R22.2 D11.A
N$33
  Top 0.61: R23.2 D12.A
N$34
  Top 0.61: R24.2 D13.A
N$35
  Top 0.61: R25.2 D14.A
N$36
  Top 0.61: D15.A R26.2
N$37
  Top 0.61: D16.A R27.2
N$38  (via drill 1 pad 1.78)
  other vias: 35.59,-58.45
N$39  (via drill 1 pad 1.78)
  other vias: 43.21,-58.45
N$40  (via drill 1 pad 1.78)
  other vias: 50.8,-58.45
N$41  (via drill 1 pad 1.78)
  other vias: 53.34,-58.45
N$42  (via drill 1 pad 1.78)
  other vias: 63.53,-58.45
N$43  (via drill 1 pad 1.78)
  other vias: 66.07,-58.45
N$44  (via drill 1 pad 1.78)
  other vias: 68.61,-58.45
N$45  (via drill 1 pad 1.78)
  other vias: 71.15,-58.45
N$46  (1 unrouted)
  Top 0.61: 1.02,12.95 105.92,12.95 105.92,-80.26 1.02,-80.26 1.02,12.95
  Bottom 0.61: 1.02,12.95 105.92,12.95 105.92,-80.26 1.02,-80.26 1.02,12.95
N$47
  pour Bottom (isolate 0.813): 1.02,12.95 105.92,12.95 105.92,-80.26 1.02,-80.26
N$48
  pour Top (isolate 0.813): 1.02,12.95 105.92,12.95 105.92,-80.26 1.02,-80.26
RX1  (via drill 0.7 pad 0.61)
  Top 0.61: v35.05,0.51 36.07,1.52 S1.2
  Bottom 0.61: 22.86,-8.89 22.86,-7.87 23.37,-7.37 28.19,-7.37 31.5,-4.06 32.77,-4.06 33.78,-3.05 33.78,0 34.29,0.51 v35.05,0.51
  Bottom 0.813: U1.19 22.86,-8.89
RX2  (via drill 0.7 pad 0.61)
  Top 0.813: S2.1 67.83,-0.76 v65.02,-0.76
  Bottom 0.813: U1.17 27.94,-12.7 29.21,-13.97 38.1,-13.97 38.86,-13.21 38.86,-9.14 40.13,-7.87 62.74,-7.87 65.02,-5.59 v65.02,-0.76
RX3
  Bottom 0.813: JP2.2 56.13,-3.3 55.37,-4.06 36.58,-4.06 34.04,-6.6 34.04,-8.38 33.02,-9.4 U1.15
RXW  (via drill 0.7 pad 0.61)
  Top 0.61: 65.53,-2.79 64.52,-2.79 62.99,-1.27 62.99,0.51 62.23,1.27 v61.47,1.27 | S2.5 70.36,-7.75 71.37,-8.76 71.37,-20.32 69.72,-21.97 69.72,-36.07 67.56,-38.23 61.21,-38.23 60.19,-39.25 U$1.RX
  Top 0.813: 70.36,-7.62 S2.5 70.36,-5.33 67.82,-2.79 65.53,-2.79
  Bottom 0.813: v61.47,1.27 60.45,2.29 56.9,2.29 56.13,3.05 JP1.2
TX1  (via drill 0.7 pad 0.61)
  Top 0.61: v45.21,1.78 44.96,1.52 S1.5
  Bottom 0.61: U1.18 25.4,-8.64 25.65,-8.38 28.96,-8.38 32,-5.33 33.27,-5.33 36.07,-2.54 40.13,-2.54 40.64,-2.03 40.64,1.02 41.4,1.78 v45.21,1.78
TX2  (via drill 0.7 pad 0.61)
  Top 0.61: v61.47,-2.79 62.48,-2.79 64.01,-4.32 65.79,-4.32 66.04,-4.57 66.04,-6.6 66.29,-6.86 67.82,-6.86 67.82,-6.38 S2.4
  Bottom 0.61: 37.34,-8.38 38.86,-6.86 57.91,-6.86 60.45,-4.32 60.45,-3.56 61.21,-2.79 v61.47,-2.79
  Bottom 0.813: U1.16 30.48,-12.19 30.73,-12.45 36.32,-12.45 37.34,-11.43 37.34,-8.38
TX3
  Bottom 0.813: JP2.1 58.67,-3.81 56.9,-5.59 37.34,-5.59 35.56,-7.37 U1.14
TXW  (via drill 0.7 pad 0.61)
  Top 0.61: v61.21,5.33 69.09,5.33 70.36,4.06 S2.2 70.36,-2.29 72.01,-3.94 73.41,-3.94 75.06,-5.59 75.06,-7.62 73.91,-8.76 73.91,-12.57 74.04,-12.7
  Top 0.813: U$1.TX 62.1,-41.01 62.1,-43.56 62.99,-44.45 67.06,-44.45 71.37,-40.13 71.37,-23.75 74.04,-21.08 74.04,-12.7
  Bottom 0.61: v61.21,5.33 60.71,5.84 JP1.1
VIN  (via drill 0.7 pad 0.61, 1 pad 1.78)
  Top 0.406: U$2.VBUS 96.04,-41.43 96.01,-41.4
  Top 0.813: v96.52,-42.16 96.52,-41.91 96.01,-41.4 | v53.59,2.16 49.91,2.16 49.02,1.27 49.02,-2.16 47.88,-3.3 27.69,-3.3 25.78,-1.4 v9.65,-1.4 | R13.2 v87,-5.59
  Bottom 0.813: J12.2 J11.2 87.12,-68.07 87.12,-65.53 90.17,-62.48 | J10.2 J9.2 72.64,-64.77 74.93,-62.48 75.69,-62.48 | 90.17,-62.48 97.54,-62.48 | 97.54,-62.48 99.82,-64.77 C2.+ 100.33,-67.56 J13.2 | 75.69,-62.48 90.17,-62.48 | J5.2 17.78,-77.22 19.3,-78.74 35.81,-78.74 36.58,-77.98 J6.2 36.58,-73.91 37.59,-72.9 46.23,-72.9 46.99,-73.66 46.99,-76.2 48.26,-77.47 57.15,-77.47 57.91,-76.71 J8.2 J7.2 57.91,-61.72 58.42,-61.21 v58.42,-58.45 U1.VIN 58.42,-56.26 59.94,-54.74 72.14,-54.74 75.69,-58.29 75.69,-62.48 | 97.54,-62.48 97.79,-62.48 98.3,-61.98 98.3,-43.94 v96.52,-42.16 96.52,-12.45 95.12,-11.05 95.12,-5.97 95.25,-5.84 | J3.2 J2.2 83.57,-2.54 86.61,-5.59 | J4.2 97.54,3.05 99.82,0.76 C1.+ 99.82,-4.83 98.81,-5.84 95.25,-5.84 | 86.61,-5.59 v87,-5.59 87.76,-5.59 95,-5.59 95.25,-5.84 | JP1.3 v53.59,2.16 JP2.3 53.59,7.75 54.61,8.76 73.03,8.76 76.45,5.33 76.45,-4.83 77.22,-5.59 86.61,-5.59 | J1.2 6.6,3.05 8.13,1.52 8.13,-1.27 9.78,-1.27 v9.65,-1.4

### Text on the board
Top: dc | rt/x2 | -+ | -+ | connect | -+ | Mega 2560 | +- | +-
Bottom: Master Bus